# EAGLE schematic sch (EAGLE 7.3.0)
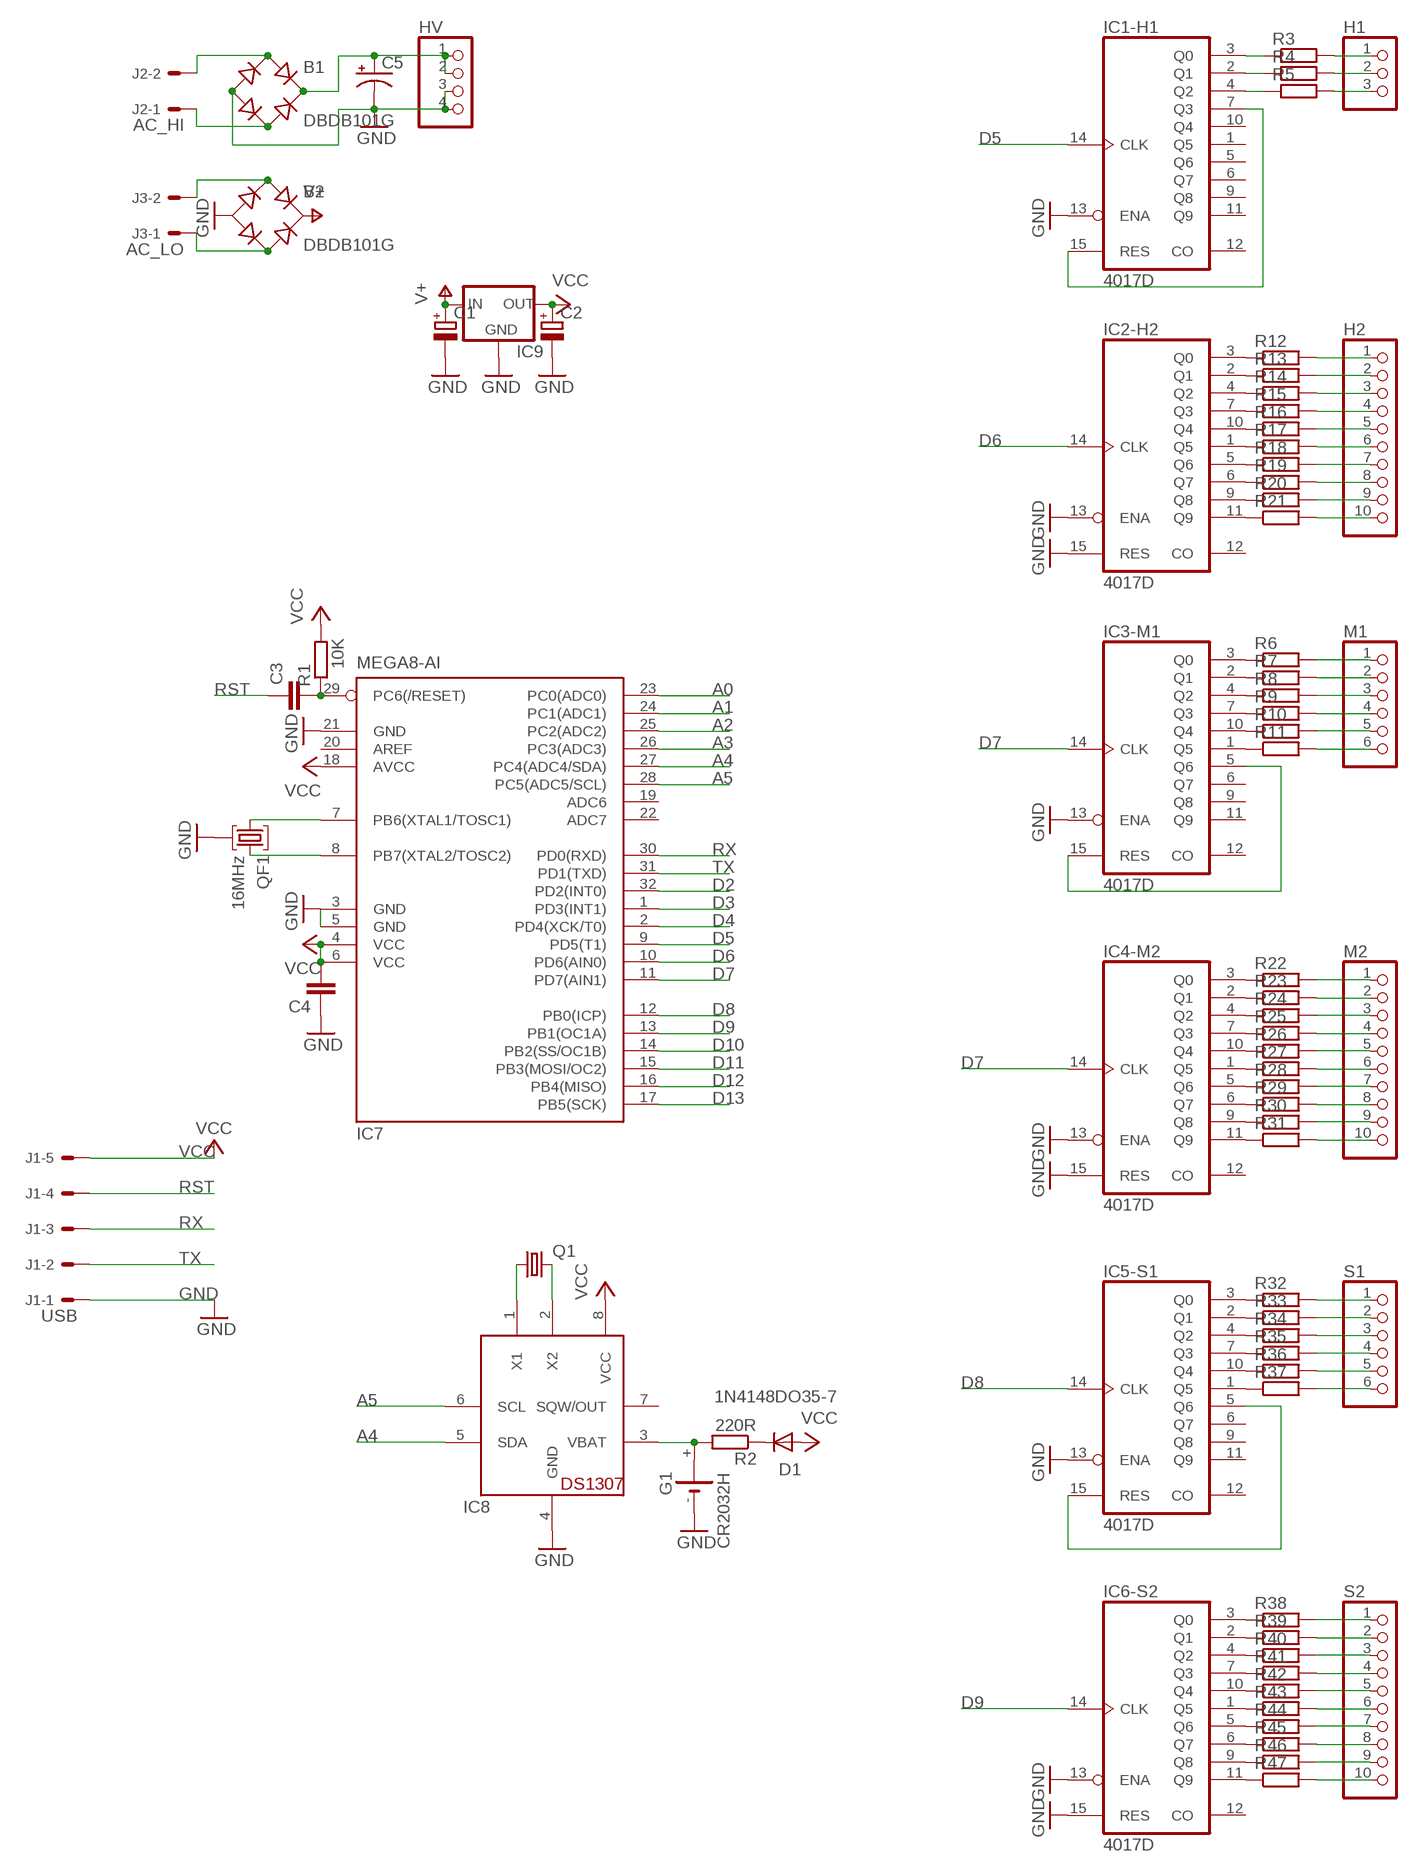
[diagram p0: schematic, sheet 1]

## Parts
B1  DBDB101G  [DB]
B2  DBDB101G  [DB]
C1  CPOL-EU140CLH-1010  [140CLH-1010]
C2  CPOL-EU140CLH-1010  [140CLH-1010]
C3  C-EUC1206K  [C1206K]
C4  C-EUC1206K  [C1206K]
C5  CPOL-USE5-13  [E5-13]
D1  1N4148DO35-7  [DO35-7]
G1  CR2032H  [CR2032H]
H1  PINHD-1X3  [1X03]
H2  PINHD-1X10  [1X10]
HV  PINHD-1X4  [1X04]
IC1-H1  4017D  [SO16]
IC2-H2  4017D  [SO16]
IC3-M1  4017D  [SO16]
IC4-M2  4017D  [SO16]
IC5-S1  4017D  [SO16]
IC6-S2  4017D  [SO16]
IC7  MEGA8-AI  [TQFP32-08]
IC8  DS1307  [DIL08]
IC9  78XXS  [78XXS]
J1  USB  22-05-7058-05  [7395-05]
J2  AC_HI  22-05-7028-02  [7395-02]
J3  AC_LO  22-05-7028-02  [7395-02]
M1  PINHD-1X6  [1X06]
M2  PINHD-1X10  [1X10]
Q1  CRYSTALTC26H  [TC26H]
QF1  16MHz  8M10AHC49T  [HC49U]
R1  10K  R-EU_0207/7  [0207/7]
R2  220R  R-EU_0207/7  [0207/7]
R3  R-EU_0204/5  [0204/5]
R4  R-EU_0204/5  [0204/5]
R5  R-EU_0204/5  [0204/5]
R6  R-EU_0204/5  [0204/5]
R7  R-EU_0204/5  [0204/5]
R8  R-EU_0204/5  [0204/5]
R9  R-EU_0204/5  [0204/5]
R10  R-EU_0204/5  [0204/5]
R11  R-EU_0204/5  [0204/5]
R12  R-EU_0204/5  [0204/5]
R13  R-EU_0204/5  [0204/5]
R14  R-EU_0204/5  [0204/5]
R15  R-EU_0204/5  [0204/5]
R16  R-EU_0204/5  [0204/5]
R17  R-EU_0204/5  [0204/5]
R18  R-EU_0204/5  [0204/5]
R19  R-EU_0204/5  [0204/5]
R20  R-EU_0204/5  [0204/5]
R21  R-EU_0204/5  [0204/5]
R22  R-EU_0204/5  [0204/5]
R23  R-EU_0204/5  [0204/5]
R24  R-EU_0204/5  [0204/5]
R25  R-EU_0204/5  [0204/5]
R26  R-EU_0204/5  [0204/5]
R27  R-EU_0204/5  [0204/5]
R28  R-EU_0204/5  [0204/5]
R29  R-EU_0204/5  [0204/5]
R30  R-EU_0204/5  [0204/5]
R31  R-EU_0204/5  [0204/5]
R32  R-EU_0204/5  [0204/5]
R33  R-EU_0204/5  [0204/5]
R34  R-EU_0204/5  [0204/5]
R35  R-EU_0204/5  [0204/5]
R36  R-EU_0204/5  [0204/5]
R37  R-EU_0204/5  [0204/5]
R38  R-EU_0204/5  [0204/5]
R39  R-EU_0204/5  [0204/5]
R40  R-EU_0204/5  [0204/5]
R41  R-EU_0204/5  [0204/5]
R42  R-EU_0204/5  [0204/5]
R43  R-EU_0204/5  [0204/5]
R44  R-EU_0204/5  [0204/5]
R45  R-EU_0204/5  [0204/5]
R46  R-EU_0204/5  [0204/5]
R47  R-EU_0204/5  [0204/5]
S1  PINHD-1X6  [1X06]
S2  PINHD-1X10  [1X10]

## Nets
A0: IC7.23(PC0(ADC0))
A1: IC7.24(PC1(ADC1))
A2: IC7.25(PC2(ADC2))
A3: IC7.26(PC3(ADC3))
A4: IC7.27(PC4(ADC4/SDA)) IC8.5(SDA)
A5: IC7.28(PC5(ADC5/SCL)) IC8.6(SCL)
D2: IC7.32(PD2(INT0))
D3: IC7.1(PD3(INT1))
D4: IC7.2(PD4(XCK/T0))
D5: IC1-H1.14(CLK) IC7.9(PD5(T1))
D6: IC2-H2.14(CLK) IC7.10(PD6(AIN0))
D7: IC3-M1.14(CLK) IC4-M2.14(CLK) IC7.11(PD7(AIN1))
D8: IC5-S1.14(CLK) IC7.12(PB0(ICP))
D9: IC6-S2.14(CLK) IC7.13(PB1(OC1A))
D10: IC7.14(PB2(SS/OC1B))
D11: IC7.15(PB3(MOSI/OC2))
D12: IC7.16(PB4(MISO))
D13: IC7.17(PB5(SCK))
GND: B1.- B2.- C1.- C2.- C4.1 C5.- G1.- HV.3 HV.4 IC1-H1.13(ENA) IC2-H2.13(ENA) IC2-H2.15(RES) IC3-M1.13(ENA) IC4-M2.13(ENA) IC4-M2.15(RES) IC5-S1.13(ENA) IC6-S2.13(ENA) IC6-S2.15(RES) IC7.3(GND) IC7.5(GND) IC7.21(GND) IC8.4(GND) IC9.GND J1.1 QF1.2
N$1: IC1-H1.3(Q0) R3.1
N$2: IC1-H1.2(Q1) R4.1
N$3: IC1-H1.7(Q3) IC1-H1.15(RES)
N$4: IC3-M1.3(Q0) R6.1
N$5: IC3-M1.2(Q1) R7.1
N$6: IC3-M1.4(Q2) R8.1
N$7: IC3-M1.7(Q3) R9.1
N$8: IC3-M1.10(Q4) R10.1
N$9: IC3-M1.1(Q5) R11.1
N$10: IC2-H2.3(Q0) R12.1
N$11: IC2-H2.2(Q1) R13.1
N$12: IC2-H2.4(Q2) R14.1
N$13: IC2-H2.7(Q3) R15.1
N$14: IC4-M2.3(Q0) R22.1
N$15: IC4-M2.2(Q1) R23.1
N$16: IC4-M2.4(Q2) R24.1
N$17: IC4-M2.7(Q3) R25.1
N$18: IC4-M2.10(Q4) R26.1
N$19: IC4-M2.1(Q5) R27.1
N$20: IC4-M2.5(Q6) R28.1
N$21: IC4-M2.6(Q7) R29.1
N$22: IC4-M2.9(Q8) R30.1
N$23: IC4-M2.11(Q9) R31.1
N$24: IC5-S1.3(Q0) R32.1
N$25: IC5-S1.2(Q1) R33.1
N$26: IC5-S1.4(Q2) R34.1
N$27: IC5-S1.7(Q3) R35.1
N$28: IC5-S1.10(Q4) R36.1
N$29: IC5-S1.5(Q6) IC5-S1.15(RES)
N$30: IC5-S1.1(Q5) R37.1
N$31: IC6-S2.3(Q0) R38.1
N$32: IC6-S2.2(Q1) R39.1
N$33: IC6-S2.4(Q2) R40.1
N$34: IC6-S2.7(Q3) R41.1
N$35: IC6-S2.10(Q4) R42.1
N$36: IC6-S2.1(Q5) R43.1
N$37: IC6-S2.5(Q6) R44.1
N$38: IC6-S2.6(Q7) R45.1
N$39: IC6-S2.9(Q8) R46.1
N$40: IC2-H2.10(Q4) R16.1
N$41: IC2-H2.1(Q5) R17.1
N$42: IC2-H2.5(Q6) R18.1
N$43: IC2-H2.6(Q7) R19.1
N$44: IC2-H2.9(Q8) R20.1
N$45: IC2-H2.11(Q9) R21.1
N$46: IC3-M1.5(Q6) IC3-M1.15(RES)
N$47: C3.2 IC7.29(PC6(/RESET)) R1.1
N$48: D1.C R2.1
N$49: B2.AC1 J3.2
N$50: B2.AC2 J3.1
N$51: IC7.7(PB6(XTAL1/TOSC1)) QF1.1
N$52: IC7.8(PB7(XTAL2/TOSC2)) QF1.3
N$53: IC8.1(X1) Q1.1
N$54: IC8.2(X2) Q1.2
N$55: G1.+ IC8.3(VBAT) R2.2
N$56: B1.AC2 J2.1
N$57: B1.AC1 J2.2
N$58: B1.+ C5.+ HV.1 HV.2
N$59: H1.1 R3.2
N$60: H1.2 R4.2
N$61: H1.3 R5.2
N$62: IC1-H1.4(Q2) R5.1
N$63: IC6-S2.11(Q9) R47.1
N$64: R47.2 S2.10
N$65: R46.2 S2.9
N$66: R45.2 S2.8
N$67: R44.2 S2.7
N$68: R43.2 S2.6
N$69: R42.2 S2.5
N$70: R41.2 S2.4
N$71: R40.2 S2.3
N$72: R39.2 S2.2
N$73: R38.2 S2.1
N$74: R32.2 S1.1
N$75: R33.2 S1.2
N$76: R34.2 S1.3
N$77: R35.2 S1.4
N$78: R36.2 S1.5
N$79: R37.2 S1.6
N$80: M2.10 R31.2
N$81: M2.9 R30.2
N$82: M2.8 R29.2
N$83: M2.7 R28.2
N$84: M2.6 R27.2
N$85: M2.5 R26.2
N$86: M2.4 R25.2
N$87: M2.3 R24.2
N$88: M2.2 R23.2
N$89: M2.1 R22.2
N$90: M1.6 R11.2
N$91: M1.5 R10.2
N$92: M1.4 R9.2
N$93: M1.3 R8.2
N$94: M1.2 R7.2
N$95: M1.1 R6.2
N$96: H2.10 R21.2
N$97: H2.9 R20.2
N$98: H2.8 R19.2
N$99: H2.7 R18.2
N$100: H2.6 R17.2
N$101: H2.5 R16.2
N$102: H2.4 R15.2
N$103: H2.1 R12.2
N$104: H2.2 R13.2
N$105: H2.3 R14.2
RST: C3.1 J1.4
RX: IC7.30(PD0(RXD)) J1.3
TX: IC7.31(PD1(TXD)) J1.2
V+: B2.+ C1.+ IC9.IN
VCC: C2.+ C4.2 D1.A IC7.4(VCC) IC7.6(VCC) IC7.18(AVCC) IC8.8(VCC) IC9.OUT J1.5 R1.2
Unconnected: G1.+@1(+) IC1-H1.1(Q5) IC1-H1.5(Q6) IC1-H1.6(Q7) IC1-H1.9(Q8) IC1-H1.10(Q4) IC1-H1.11(Q9) IC1-H1.12(CO) IC2-H2.12(CO) IC3-M1.6(Q7) IC3-M1.9(Q8) IC3-M1.11(Q9) IC3-M1.12(CO) IC4-M2.12(CO) IC5-S1.6(Q7) IC5-S1.9(Q8) IC5-S1.11(Q9) IC5-S1.12(CO) IC6-S2.12(CO) IC7.19(ADC6) IC7.20(AREF) IC7.22(ADC7) IC8.7(SQW/OUT)

## Power pins joined to a net without a drawn wire
VDD: IC1-H1.16(VDD) IC2-H2.16(VDD) IC3-M1.16(VDD) IC4-M2.16(VDD) IC5-S1.16(VDD) IC6-S2.16(VDD)
VSS: IC1-H1.8(VSS) IC2-H2.8(VSS) IC3-M1.8(VSS) IC4-M2.8(VSS) IC5-S1.8(VSS) IC6-S2.8(VSS)

## Library data of the parts
B1 B2 = rectifier:DB?*G: Single Phase 1.0 AMP Glass Passivated Bridge Rectifier Taiwan Semiconductor Co.,Ltd. - TSC Source: http://www.taiwansemi.com/TSCbig5/ezcatfiles/cust/img/img/db101g.pdf http://www.ts.com.tw/db/pictures/modules/PDT/PDT060207001/DBLS201G.pdf
C1 C2 = rcl:CPOL-EU: POLARIZED CAPACITOR, European symbol
C3 C4 = rcl:C-EU: CAPACITOR, European symbol
C5 = rcl:CPOL-US: POLARIZED CAPACITOR, American symbol
D1 = diode:1N4148: DIODE high speed (Philips)
G1 = battery:CR2032H: LI BATTERY Varta
H1 = pinhead:PINHD-1X3: PIN HEADER
H2 M2 S2 = pinhead:PINHD-1X10: PIN HEADER
HV = pinhead:PINHD-1X4: PIN HEADER
IC1-H1 IC2-H2 IC3-M1 IC4-M2 IC5-S1 IC6-S2 = 40xx:4017: COUNTER/DIVIDER
IC7 = atmel:MEGA8: MICROCONTROLLER 8 Kbytes FLASH, 1 kbytes SRAM, 512 bytes EEPROM, USART, 6-channel 10 bit ADC, 2-channel 8 bit ADC Pin compatible with Atmega48, ATMega88, ATMega168 Source: avr.lbr; MPN: ATMEGA8-16AU; OC_FARNELL: 9171371; OC_NEWARK: 73M8863
IC8 = adafruit:DS1307: DS1307 Real time clock (RTC) with battery backup ability. Talk to it via i2c
IC9 = v-reg:78XXS: VOLTAGE REGULATOR
J1 = con-molex:22-?-05: CONNECTOR wire to board 2.54 mm (.1 inch) pitch header; OC_FARNELL: unknown; OC_NEWARK: unknown
J2 J3 = con-molex:22-?-02: CONNECTOR wire to board 2.54 mm (.1 inch) pitch header; OC_FARNELL: 9731601; OC_NEWARK: unknown
M1 S1 = pinhead:PINHD-1X6: PIN HEADER
Q1 = crystal:CRYSTAL: CRYSTAL; OC_FARNELL: unknown; OC_NEWARK: unknown
QF1 = crystal:8M10AHC49T: Monolithic Crystal Filters Source: www.vanlong.com; OC_FARNELL: unknown; OC_NEWARK: unknown
R1-R47 = rcl:R-EU_: RESISTOR, European symbol